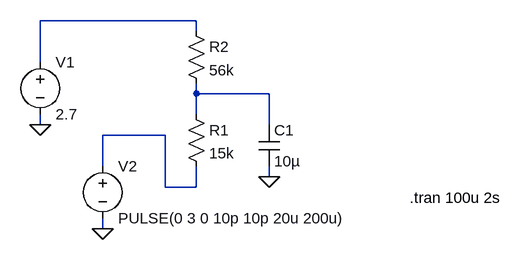
[diagram p0: schematic design.asc]
design.asc, the LTspice schematic file:
Version 4
SHEET 1 880 680
WIRE 256 80 16 80
WIRE 256 96 256 80
WIRE 16 144 16 80
WIRE 256 192 256 176
WIRE 368 192 256 192
WIRE 256 224 256 192
WIRE 16 240 16 224
WIRE 368 240 368 192
WIRE 208 256 112 256
WIRE 112 304 112 256
WIRE 368 320 368 304
WIRE 208 336 208 256
WIRE 256 336 256 304
WIRE 256 336 208 336
WIRE 112 400 112 384
FLAG 112 400 0
FLAG 16 240 0
FLAG 368 320 0
SYMBOL Res 240 208 R0
SYMATTR InstName R1
SYMATTR Value 15k
SYMBOL Voltage 16 128 R0
SYMATTR InstName V1
SYMATTR Value 2.7
SYMBOL Voltage 112 288 R0
SYMATTR InstName V2
SYMATTR Value PULSE(0 3 0 10p 10p 20u 200u)
SYMBOL Cap 352 240 R0
SYMATTR InstName C1
SYMATTR Value 10µ
SYMBOL Res 240 80 R0
SYMATTR InstName R2
SYMATTR Value 56k
TEXT 584 352 Left 2 !.tran 100u 2s

The netlist it stands for:
* design.asc
R1 N002 N003 15k
V1 N001 0 2.7
V2 N003 0 PULSE(0 3 0 10p 10p 20u 200u)
C1 N002 0 10µ
R2 N001 N002 56k
.tran 100u 2s
.backanno
.end